# Altium schematic sheet Port.SchDoc
size A4; SheetNumber: 1; SheetTotal: 4
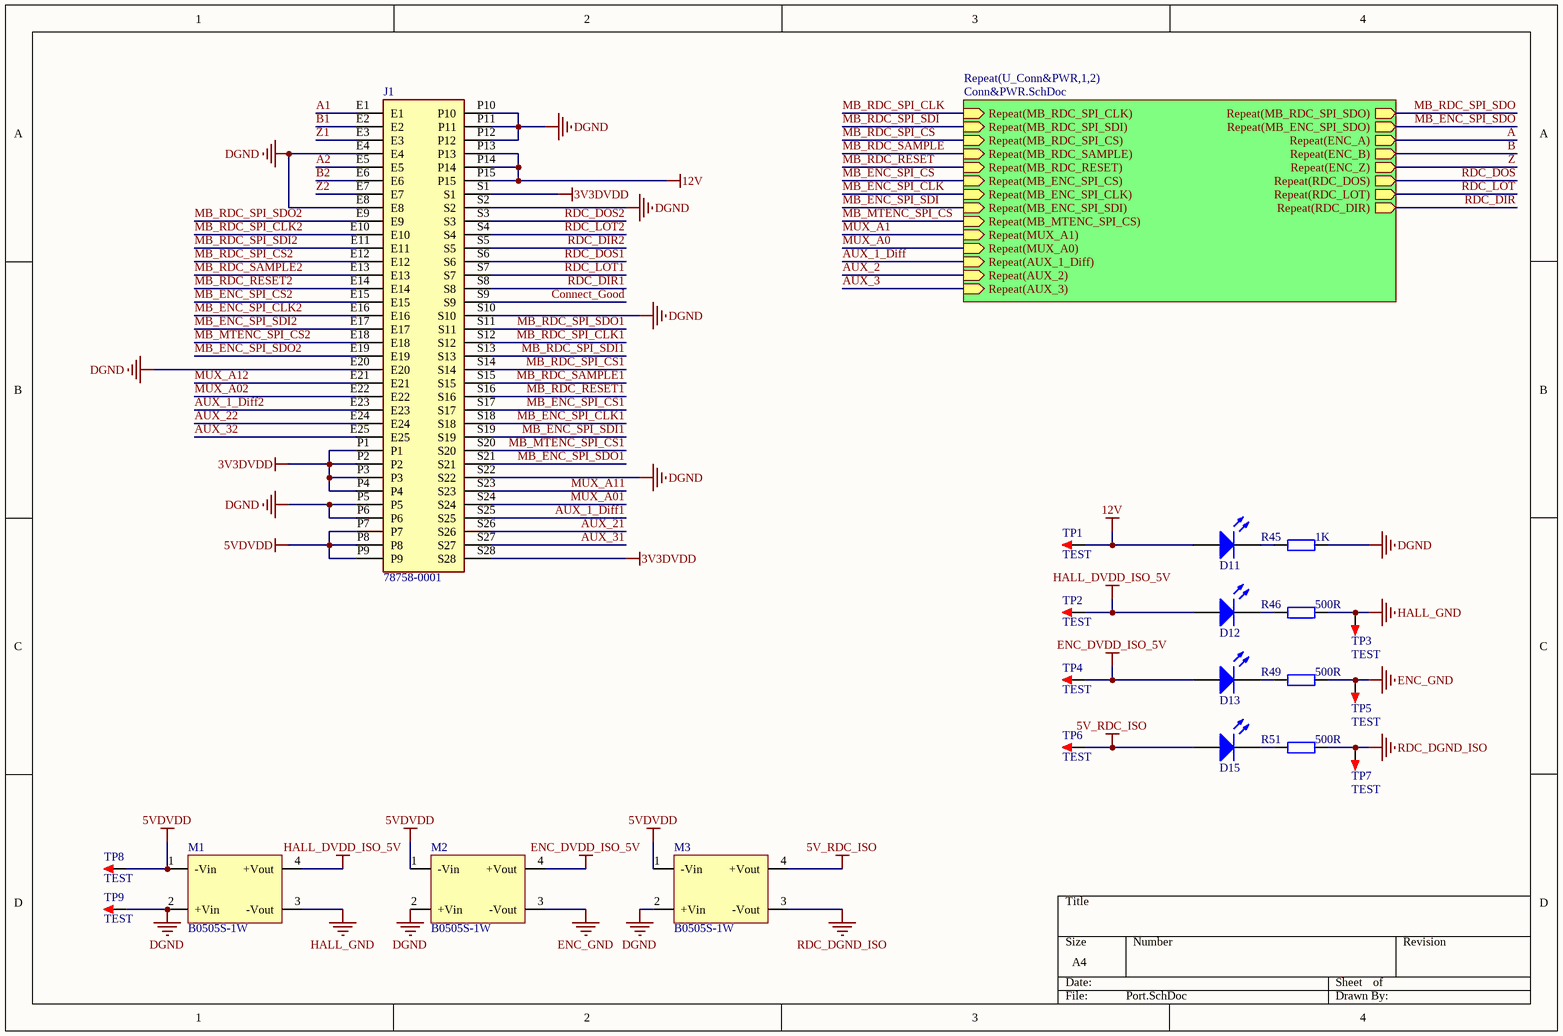
[diagram p0: Port.SchDoc]

## Parts
D11  LED  [LED 0603W]  (value not drawn)
D12  LED  [LED 0603W]  (value not drawn)
D13  LED  [LED 0603W]  (value not drawn)
D15  LED  [LED 0603W]  (value not drawn)
J1  78758-0001  [78758-0001]
M1  B0505S-1W  [B0505S-1W]
M2  B0505S-1W  [B0505S-1W]
M3  B0505S-1W  [B0505S-1W]
R45  1K  [R 0603_L]
R46  500R  [R 0603_L]
R49  500R  [R 0603_L]
R51  500R  [R 0603_L]
TP1  TEST  [TEST 1.6]
TP2  TEST  [TEST 1.6]
TP3  TEST  [TEST 1.6]
TP4  TEST  [TEST 1.6]
TP5  TEST  [TEST 1.6]
TP6  TEST  [TEST 1.6]
TP7  TEST  [TEST 1.6]
TP8  TEST  [TEST 1.6]
TP9  TEST  [TEST 1.6]

## Sub-sheets
Repeat(U_Conn&PWR,1,2) = Conn&PWR.SchDoc: Repeat(MB_RDC_SPI_CLK) (in), Repeat(MB_RDC_SPI_SDI) (in), Repeat(MB_RDC_SPI_CS) (in), Repeat(MB_RDC_SAMPLE) (in), Repeat(MB_RDC_SPI_SDO) (out), Repeat(MB_RDC_RESET) (in), Repeat(MB_ENC_SPI_SDO) (out), Repeat(MB_ENC_SPI_CS) (in), Repeat(MB_ENC_SPI_CLK) (in), Repeat(MB_ENC_SPI_SDI) (in), Repeat(MB_MTENC_SPI_CS) (in), Repeat(ENC_A) (out), Repeat(ENC_B) (out), Repeat(ENC_Z) (out), Repeat(MUX_A1) (in), Repeat(MUX_A0) (in), Repeat(RDC_DOS) (out), Repeat(RDC_LOT) (out), Repeat(RDC_DIR) (out), Repeat(AUX_1_Diff) (in), Repeat(AUX_2) (in), Repeat(AUX_3) (in)

## Nets
3V3DVDD: J1.P1 J1.P2 J1.P3 J1.P4 J1.S1 J1.S28
5V_RDC_ISO: D15.1(A) M3.4(+Vout) TP6.1
5VDVDD: J1.P7 J1.P8 J1.P9 M1.1(-Vin) M2.1(-Vin) M3.1(-Vin) TP8.1
12V: D11.1(A) J1.P13 J1.P14 J1.P15 TP1.1
DGND: J1.E4 J1.E8 J1.E20 J1.P5 J1.P6 J1.P10 J1.P11 J1.P12 J1.S2 J1.S10 J1.S22 M1.2(+Vin) M2.2(+Vin) M3.2(+Vin) R45.1 TP9.1
ENC_DVDD_ISO_5V: D13.1(A) M2.4(+Vout) TP4.1
ENC_GND: M2.3(-Vout) R49.1 TP5.1
HALL_DVDD_ISO_5V: D12.1(A) M1.4(+Vout) TP2.1
HALL_GND: M1.3(-Vout) R46.1 TP3.1
RDC_DGND_ISO: M3.3(-Vout) R51.1 TP7.1
A: sheet Repeat(U_Conn&PWR,1,2)/Repeat(ENC_A)
A1: J1.E1
A2: J1.E5
AUX_1_Diff: sheet Repeat(U_Conn&PWR,1,2)/Repeat(AUX_1_Diff)
AUX_1_Diff1: J1.S25
AUX_1_Diff2: J1.E23
AUX_2: sheet Repeat(U_Conn&PWR,1,2)/Repeat(AUX_2)
AUX_3: sheet Repeat(U_Conn&PWR,1,2)/Repeat(AUX_3)
AUX_21: J1.S26
AUX_22: J1.E24
AUX_31: J1.S27
AUX_32: J1.E25
B: sheet Repeat(U_Conn&PWR,1,2)/Repeat(ENC_B)
B1: J1.E2
B2: J1.E6
Connect_Good: J1.S9
MB_ENC_SPI_CLK: sheet Repeat(U_Conn&PWR,1,2)/Repeat(MB_ENC_SPI_CLK)
MB_ENC_SPI_CLK1: J1.S18
MB_ENC_SPI_CLK2: J1.E16
MB_ENC_SPI_CS: sheet Repeat(U_Conn&PWR,1,2)/Repeat(MB_ENC_SPI_CS)
MB_ENC_SPI_CS1: J1.S17
MB_ENC_SPI_CS2: J1.E15
MB_ENC_SPI_SDI: sheet Repeat(U_Conn&PWR,1,2)/Repeat(MB_ENC_SPI_SDI)
MB_ENC_SPI_SDI1: J1.S19
MB_ENC_SPI_SDI2: J1.E17
MB_ENC_SPI_SDO: sheet Repeat(U_Conn&PWR,1,2)/Repeat(MB_ENC_SPI_SDO)
MB_ENC_SPI_SDO1: J1.S21
MB_ENC_SPI_SDO2: J1.E19
MB_MTENC_SPI_CS: sheet Repeat(U_Conn&PWR,1,2)/Repeat(MB_MTENC_SPI_CS)
MB_MTENC_SPI_CS1: J1.S20
MB_MTENC_SPI_CS2: J1.E18
MB_RDC_RESET: sheet Repeat(U_Conn&PWR,1,2)/Repeat(MB_RDC_RESET)
MB_RDC_RESET1: J1.S16
MB_RDC_RESET2: J1.E14
MB_RDC_SAMPLE: sheet Repeat(U_Conn&PWR,1,2)/Repeat(MB_RDC_SAMPLE)
MB_RDC_SAMPLE1: J1.S15
MB_RDC_SAMPLE2: J1.E13
MB_RDC_SPI_CLK: sheet Repeat(U_Conn&PWR,1,2)/Repeat(MB_RDC_SPI_CLK)
MB_RDC_SPI_CLK1: J1.S12
MB_RDC_SPI_CLK2: J1.E10
MB_RDC_SPI_CS: sheet Repeat(U_Conn&PWR,1,2)/Repeat(MB_RDC_SPI_CS)
MB_RDC_SPI_CS1: J1.S14
MB_RDC_SPI_CS2: J1.E12
MB_RDC_SPI_SDI: sheet Repeat(U_Conn&PWR,1,2)/Repeat(MB_RDC_SPI_SDI)
MB_RDC_SPI_SDI1: J1.S13
MB_RDC_SPI_SDI2: J1.E11
MB_RDC_SPI_SDO: sheet Repeat(U_Conn&PWR,1,2)/Repeat(MB_RDC_SPI_SDO)
MB_RDC_SPI_SDO1: J1.S11
MB_RDC_SPI_SDO2: J1.E9
MUX_A0: sheet Repeat(U_Conn&PWR,1,2)/Repeat(MUX_A0)
MUX_A01: J1.S24
MUX_A1: sheet Repeat(U_Conn&PWR,1,2)/Repeat(MUX_A1)
MUX_A02: J1.E22
MUX_A11: J1.S23
MUX_A12: J1.E21
RDC_DIR: sheet Repeat(U_Conn&PWR,1,2)/Repeat(RDC_DIR)
RDC_DIR1: J1.S8
RDC_DIR2: J1.S5
RDC_DOS: sheet Repeat(U_Conn&PWR,1,2)/Repeat(RDC_DOS)
RDC_DOS1: J1.S6
RDC_DOS2: J1.S3
RDC_LOT: sheet Repeat(U_Conn&PWR,1,2)/Repeat(RDC_LOT)
RDC_LOT1: J1.S7
RDC_LOT2: J1.S4
Z: sheet Repeat(U_Conn&PWR,1,2)/Repeat(ENC_Z)
Z1: J1.E3
Z2: J1.E7
NetD11_2: D11.2(K) R45.2
NetD12_2: D12.2(K) R46.2
NetD13_2: D13.2(K) R49.2
NetD15_2: D15.2(K) R51.2

## Library data of the parts
D11-D13 D15 = LED: 发光二极管; 技术支持，联系售后: https://shop463601444.taobao.com
J1 = 78758-0001: Connector; Manufacturer_Name: Molex; Manufacturer_Part_Number: 78758-0001; Mouser Part Number: 538-78758-0001; Mouser Price/Stock: https://www.mouser.co.uk/ProductDetail/Molex/78758-0001?qs=wOSGPAwRNAFEK7d2ROR5rw%3D%3D
M1-M3 = B0505S-1W: DC-DC模块; 版权归属: 封装库来自淘宝 ID：黄晶宝石; BOM名称: DC-DC模块; 学习资源: https://shop463601444.taobao.com
R45 R46 R49 R51 = R: 贴片电阻; 版权归属: 来自淘宝 ID：黄晶宝石; 封装库来自淘宝卖家 ID：黄晶宝石: 其他店铺购入均为盗版，不享受售后技术支持服务，请立即申请退款; BOM名称: 贴片电阻; 联系售后: https://shop463601444.taobao.com
TP1-TP9 = TEST: 测试点; 版权归属: 封装库来自淘宝 ID：黄晶宝石; BOM名称: 测试点; 学习资源: https://shop463601444.taobao.com